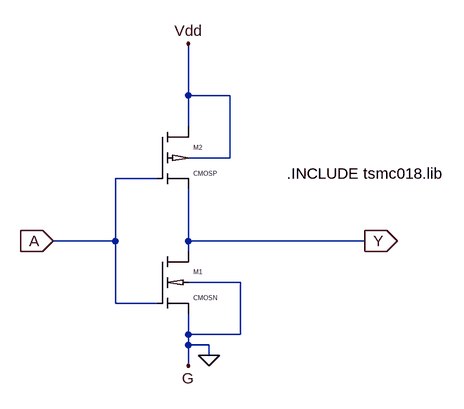
[diagram p0: schematic CMOS3.asc]
CMOS3.asc, the LTspice schematic file:
Version 4
SHEET 1 880 680
WIRE 176 -80 176 -160
WIRE 240 -80 176 -80
WIRE 176 -32 176 -80
WIRE 240 16 240 -80
WIRE 240 16 176 16
WIRE 128 48 64 48
WIRE 64 144 64 48
WIRE 64 144 -32 144
WIRE 176 144 176 64
WIRE 448 144 176 144
WIRE 176 160 176 144
WIRE 256 208 176 208
WIRE 64 240 64 144
WIRE 128 240 64 240
WIRE 176 288 176 256
WIRE 256 288 256 208
WIRE 256 288 176 288
WIRE 176 304 176 288
WIRE 208 304 176 304
WIRE 208 320 208 304
WIRE 176 336 176 304
FLAG -32 144 A
IOPIN -32 144 In
FLAG 448 144 Y
IOPIN 448 144 Out
FLAG 176 -160 Vdd
FLAG 176 336 G
FLAG 208 320 0
SYMBOL Ncmos 128 160 R0
SYMATTR InstName M1
SYMBOL Pcmos 128 -32 R0
SYMATTR InstName M2
TEXT 328 40 Left 2 !.INCLUDE tsmc018.lib

The netlist it stands for:
* CMOS3.asc
M1 Y A 0 0 CMOSN
M2 Vdd A Y Vdd CMOSP
.model NMOS NMOS
.model PMOS PMOS
.lib standard.mos
.INCLUDE tsmc018.lib
.lib tsmc018.lib
.backanno
.end